# Altium project lsr_pwr.PrjPCB
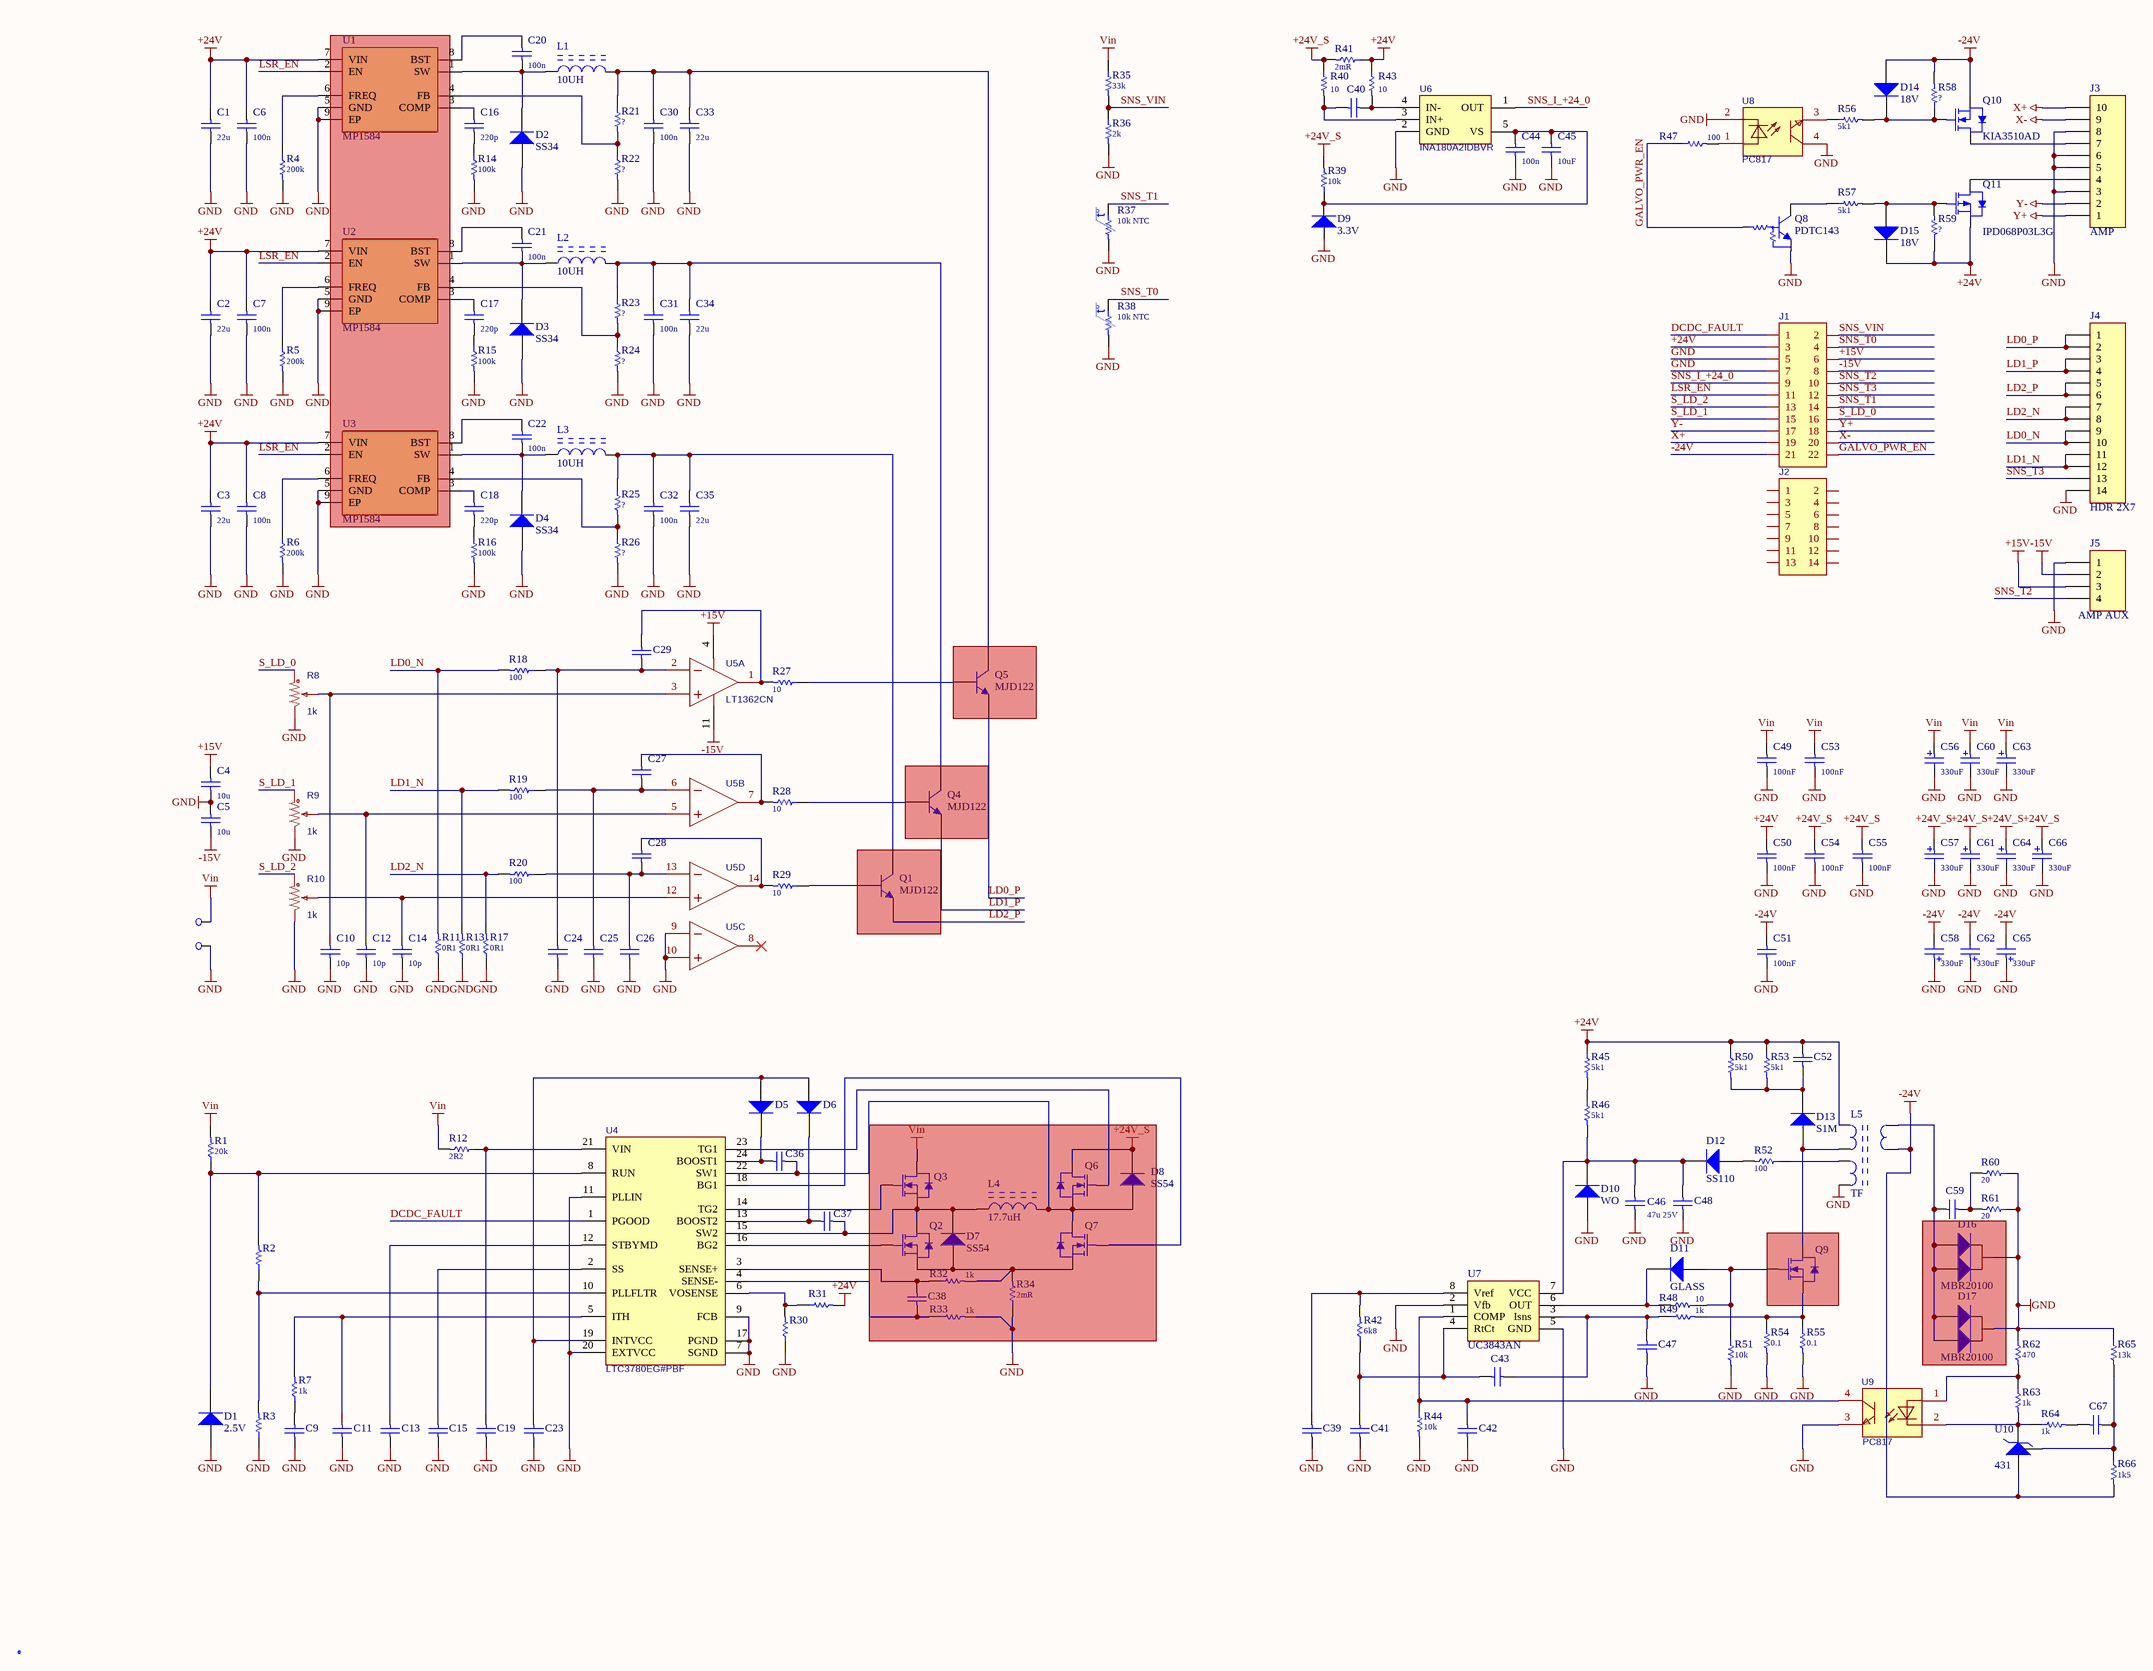
[diagram p0: schematic.SchDoc]
PRJ_ID: LSR Power; PRJ_VER: v1.0.0
1 sheet, 184 parts. Net scope: global (net labels, ports and power ports of the same name join across sheets).
Board file: board.PcbDoc

## Sheet schematic.SchDoc: Display & buttons board
size A2; Revision: 1; SheetNumber: 6; SheetTotal: 29

### Parts
C1  22u  [C1210]
C2  22u  [C1210]
C3  22u  [C1210]
C4  10u  [C1210]
C5  10u  [C1210]
C6  100n  [C0603]
C7  100n  [C0603]
C8  100n  [C0603]
C9  (no value)  [C0805]  (no BOM)
C10  10p  [C0402]
C11  (no value)  [C0805]  (no BOM)
C12  10p  [C0402]
C13  (no value)  [C0805]  (no BOM)
C14  10p  [C0402]
C15  (no value)  [C1206]  (no BOM)
C16  220p  [C0603]
C17  220p  [C0603]
C18  220p  [C0603]
C19  (no value)  [C0805]  (no BOM)
C20  100n  [C0603]
C21  100n  [C0603]
C22  100n  [C0603]
C23  (no value)  [C1206]  (no BOM)
C24  10p  [C0402]  (value not drawn)
C25  10p  [C0402]  (value not drawn)
C26  10p  [C0402]  (value not drawn)
C27  10p  [C0402]  (value not drawn)
C28  10p  [C0402]  (value not drawn)
C29  10p  [C0402]  (value not drawn)
C30  100n  [C0603]
C31  100n  [C0603]
C32  100n  [C0603]
C33  22u  [C1210]
C34  22u  [C1210]
C35  22u  [C1210]
C36  (no value)  [C0805]  (no BOM)
C37  (no value)  [C0805]  (no BOM)
C38  (no value)  [C0805]  (no BOM)
C39  (no value)  [C0805]  (no BOM)
C40  (no value)  [C0805]
C41  (no value)  [C0805]  (no BOM)
C42  (no value)  [C0805]  (no BOM)
C43  (no value)  [C0805]  (no BOM)
C44  100n  [C0603]
C45  10uF  [C0805]
C46  47u 25V  [C7343]  (no BOM)
C47  (no value)  [C0805]  (no BOM)
C48  (no value)  [C0805]  (no BOM)
C49  100nF  [C1210]
C50  100nF  [C1210]
C51  100nF  [C1210]
C52  (no value)  [C1206]  (no BOM)
C53  100nF  [C1210]
C54  100nF  [C1210]
C55  100nF  [C1210]
C56  330uF  [CAP-SMD_BD10.0-L10.3-W10.3-LS11.0-FD]
C57  330uF  [CAP-SMD_BD10.0-L10.3-W10.3-LS11.0-FD]
C58  330uF  [CAP-SMD_BD10.0-L10.3-W10.3-LS11.0-FD]
C59  (no value)  [C1206]  (no BOM)
C60  330uF  [CAP-SMD_BD10.0-L10.3-W10.3-LS11.0-FD]
C61  330uF  [CAP-SMD_BD10.0-L10.3-W10.3-LS11.0-FD]
C62  330uF  [CAP-SMD_BD10.0-L10.3-W10.3-LS11.0-FD]
C63  330uF  [CAP-SMD_BD10.0-L10.3-W10.3-LS11.0-FD]
C64  330uF  [CAP-SMD_BD10.0-L10.3-W10.3-LS11.0-FD]
C65  330uF  [CAP-SMD_BD10.0-L10.3-W10.3-LS11.0-FD]
C66  330uF  [CAP-SMD_BD10.0-L10.3-W10.3-LS11.0-FD]
C67  (no value)  [C0805]  (no BOM)
D1  2.5V  [sod-123]
D2  SS34  [SMA]
D3  SS34  [SMA]
D4  SS34  [SMA]
D5  (no value)  [SOD-323]  (no BOM)
D6  (no value)  [SOD-323]  (no BOM)
D7  SS54  [SMB]  (no BOM)
D8  SS54  [SMB]  (no BOM)
D9  3.3V  [sod-123]
D10  WO  [SMA]  (no BOM)
D11  GLASS  [SMA]  (no BOM)
D12  SS110  [SMA]  (no BOM)
D13  S1M  [SMA]  (no BOM)
D14  18V  [SOD-123]
D15  18V  [SOD-123]
D16  MBR20100  [D2PAK]
D17  MBR20100  [D2PAK]
DN1  (no value)  [PAD_CAST2_0.8MM]  (no BOM)
DN2  (no value)  [PAD_CAST2_0.8MM]  (no BOM)
J1  (no value)  [HDR-2X11-P2.00]
J2  (no value)  [HDR-2X7-P2.00]
J3  AMP  [HDR-1X10_2.54]  (no BOM)
J4  HDR 2X7  [HDR-2X7-P2.00]
J5  AMP AUX  [HDR-2X2-P2.00]  (no BOM)
L1  10UH  [IND-SMD_L7.2-W6.6_GPSR07X0]
L2  10UH  [IND-SMD_L7.2-W6.6_GPSR07X0]
L3  10UH  [IND-SMD_L7.2-W6.6_GPSR07X0]
L4  17.7uH  [IND_PWR_0]  (no BOM)
L5  TF  [TRANS_0]  (no BOM)
LOGO1  LOGO  [LOGO]  (value not drawn)  (no BOM)
Q1  MJD122  [TO-252AA (DPAK)]
Q2  AOD4184  [TO-252AA (DPAK)]  (value not drawn)  (no BOM)
Q3  AOD4184  [TO-252AA (DPAK)]  (value not drawn)  (no BOM)
Q4  MJD122  [TO-252AA (DPAK)]
Q5  MJD122  [TO-252AA (DPAK)]
Q6  AOD4184  [TO-252AA (DPAK)]  (value not drawn)  (no BOM)
Q7  AOD4184  [TO-252AA (DPAK)]  (value not drawn)  (no BOM)
Q8  PDTC143  [SOT-23]
Q9  MDP1991  [D2PAK]  (value not drawn)
Q10  KIA3510AD  [TO-252AA (DPAK)]
Q11  IPD068P03L3G  [TO-252AA (DPAK)]
R1  20k  [R0805]
R2  (no value)  [R0805]  (no BOM)
R3  (no value)  [R0805]  (no BOM)
R4  200k  [R0603]
R5  200k  [R0603]
R6  200k  [R0603]
R7  1k  [R0805]  (no BOM)
R8  1k  [RES-ADJ-TH_3P-L10.0-W10.0-P2.50-L]
R9  1k  [RES-ADJ-TH_3P-L10.0-W10.0-P2.50-L]
R10  1k  [RES-ADJ-TH_3P-L10.0-W10.0-P2.50-L]
R11  0R1  [R1206]
R12  2R2  [R0805]  (no BOM)
R13  0R1  [R1206]
R14  100k  [R0603]
R15  100k  [R0603]
R16  100k  [R0603]
R17  0R1  [R1206]
R18  100  [R0402]
R19  100  [R0402]
R20  100  [R0402]
R21  ?  [R0603]
R22  ?  [R0603]
R23  ?  [R0603]
R24  ?  [R0603]
R25  ?  [R0603]
R26  ?  [R0603]
R27  10  [R0805]
R28  10  [R0805]
R29  10  [R0805]
R30  (no value)  [R0805]  (no BOM)
R31  (no value)  [R0805]  (no BOM)
R32  1k  [R0805]  (no BOM)
R33  1k  [R0805]  (no BOM)
R34  2mR  [R2512-WIDE]  (no BOM)
R35  33k  [R0603]
R36  2k  [R0603]
R37  10k NTC  [R0402]
R38  10k NTC  [R0402]
R39  10k  [R0805]
R40  10  [R0603]
R41  2mR  [R2512-WIDE]
R42  6k8  [R0805]  (no BOM)
R43  10  [R0603]
R44  10k  [R0805]  (no BOM)
R45  5k1  [R1206]  (no BOM)
R46  5k1  [R1206]  (no BOM)
R47  100  [R0603]
R48  10  [R0805]  (no BOM)
R49  1k  [R0805]  (no BOM)
R50  5k1  [R1206]  (no BOM)
R51  10k  [R0805]  (no BOM)
R52  100  [R1206]  (no BOM)
R53  5k1  [R1206]  (no BOM)
R54  0.1  [R1206]  (no BOM)
R55  0.1  [R1206]  (no BOM)
R56  5k1  [R0805]
R57  5k1  [R0805]
R58  ?  [R0805]
R59  ?  [R0805]
R60  20  [R1206]  (no BOM)
R61  20  [R1206]  (no BOM)
R62  470  [R0805]  (no BOM)
R63  1k  [R0805]  (no BOM)
R64  1k  [R0805]  (no BOM)
R65  13k  [R0805]  (no BOM)
R66  1k5  [R0805]  (no BOM)
U1  MP1584  [PowerSOIC-8]
U2  MP1584  [PowerSOIC-8]
U3  MP1584  [PowerSOIC-8]
U4  LTC3780EG#PBF  [SSOP-24]  (no BOM)
U5  LT1362CN  [DIP-14]  (parts A,B,C,D of 4)
U6  INA180A2IDBVR  [SOT-23-5]
U7  UC3843AN  [SO-8]  (no BOM)
U8  PC817  [SMD-4]
U9  PC817  [SMD-4]  (no BOM)
U10  431  [SOT-23]  (no BOM)

### Nets
+15V: C4.2 J1.6 J5.3 U5.4(V+)
+24V: C1.2 C2.2 C3.2 C6.2 C7.2 C8.2 C50.2 C52.1 D15.2(K) J1.3 L5.1 Q11.3(SOURCE) R31.2 R41.1 R43.1 R45.1 R50.1 R53.1 R59.1 U1.7(VIN) U2.7(VIN) U3.7(VIN)
+24V_S: C54.2 C55.2 C57.1 C61.1 C64.1 C66.1 D8.2(K) Q6.2(DRAIN) R39.2 R40.1 R41.2
-15V: C5.1 J1.8 J5.2 U5.11(V-)
-24V: C51.2 C58.2 C62.2 C65.2 D14.1(A) J1.21 L5.5 Q10.3(SOURCE) R58.2 R66.2 U10.3(A)
GND: C1.1 C2.1 C3.1 C4.1 C5.2 C6.1 C7.1 C8.1 C9.2 C10.1 C11.2 C12.1 C13.2 C14.1 C15.2 C19.2 C23.2 C24.1 C25.1 C26.1 C30.1 C31.1 C32.1 C33.1 C34.1 C35.1 C39.2 C41.2 C42.1 C44.1 C45.1 C46.2 C47.2 C48.2 C49.1 C50.1 C51.1 C53.1 C54.1 C55.1 C56.2 C57.2 C58.1 C60.2 C61.2 C62.1 C63.2 C64.2 C65.1 C66.2 D1.1(A) D2.1(A) D3.1(A) D4.1(A) D9.1(A) D10.1(A) D16.2(A) D17.2(A) DN2.1 J1.5 J1.7 J3.3 J3.5 J3.6 J3.8 J4.14 J5.1 L5.3 Q8.2(E) R3.1 R4.2 R5.2 R6.2 R8.3 R9.3 R10.3 R11.1 R13.1 R14.2 R15.2 R16.2 R17.1 R22.2 R24.2 R26.2 R30.1 R33.2 R34.1 R36.2 R37.2 R38.2 R44.2 R51.2 R54.2 R55.2 R60.1 R61.1 R62.1 R65.1 U1.5(GND) U1.9(EP) U2.5(GND) U2.9(EP) U3.5(GND) U3.9(EP) U4.7(SGND) U4.9(FCB) U4.11(PLLIN) U4.17(PGND) U4.20(EXTVCC) U5.9(INC-) U5.10(INC+) U6.2(GND) U7.2(Vfb) U7.5(GND) U8.2 U8.4 U9.3
Vin: C49.2 C53.2 C56.1 C60.1 C63.1 DN1.1 Q3.2(DRAIN) R1.2 R12.2 R35.1
X+: J1.19 J3.10
X-: J1.20 J3.9
Y+: J1.18 J3.1
Y-: J1.17 J3.2
DCDC_FAULT: J1.1 U4.1(PGOOD)
GALVO_PWR_EN: J1.22 Q8.1(B) R47.1
LD0_N: J4.9 J4.10 R11.2 R18.2
LD0_P: J4.1 J4.2 Q5.3(E)
LD1_N: J4.11 J4.12 R13.2 R19.2
LD1_P: J4.3 J4.4 Q4.3(E)
LD2_N: J4.7 J4.8 R17.2 R20.2
LD2_P: J4.5 J4.6 Q1.3(E)
LSR_EN: J1.11 U1.2(EN) U2.2(EN) U3.2(EN)
S_LD_0: J1.16 R8.1
S_LD_1: J1.15 R9.1
S_LD_2: J1.13 R10.1
SNS_I_+24_0: J1.9 U6.1(OUT)
SNS_T0: J1.4 R38.1
SNS_T1: J1.14 R37.1
SNS_T2: J1.10 J5.4
SNS_T3: J1.12 J4.13
SNS_VIN: J1.2 R35.2 R36.1
NetC9_1: C9.1 R7.1
NetC10_2: C10.2 R8.2 U5.3(INA+)
NetC11_1: C11.1 R7.2 U4.5(ITH)
NetC12_2: C12.2 R9.2 U5.5(INB+)
NetC13_1: C13.1 U4.12(STBYMD)
NetC14_2: C14.2 R10.2 U5.12(IND+)
NetC15_1: C15.1 U4.2(SS)
NetC16_1: C16.1 R14.1
NetC16_2: C16.2 U1.3(COMP)
NetC17_1: C17.1 R15.1
NetC17_2: C17.2 U2.3(COMP)
NetC18_1: C18.1 R16.1
NetC18_2: C18.2 U3.3(COMP)
NetC19_1: C19.1 R12.1 U4.21(VIN)
NetC20_1: C20.1 D2.2(K) L1.1 U1.1(SW)
NetC20_2: C20.2 U1.8(BST)
NetC21_1: C21.1 D3.2(K) L2.1 U2.1(SW)
NetC21_2: C21.2 U2.8(BST)
NetC22_1: C22.1 D4.2(K) L3.1 U3.1(SW)
NetC22_2: C22.2 U3.8(BST)
NetC23_1: C23.1 D5.1(A) D6.1(A) U4.19(INTVCC)
NetC24_2: C24.2 C29.2 R18.1 U5.2(INA-)
NetC25_2: C25.2 C27.1 R19.1 U5.6(INB-)
NetC26_2: C26.2 C28.1 R20.1 U5.13(IND-)
NetC27_2: C27.2 R28.2 U5.7(OUTB)
NetC28_2: C28.2 R29.2 U5.14(OUTD)
NetC29_1: C29.1 R27.2 U5.1(OUTA)
NetC30_2: C30.2 C33.2 L1.2 Q5.2(C) R21.1
NetC31_2: C31.2 C34.2 L2.2 Q4.2(C) R23.1
NetC32_2: C32.2 C35.2 L3.2 Q1.2(C) R25.1
NetC36_1: C36.1 D5.2(K) U4.24(BOOST1)
NetC36_2: C36.2 D8.1(A) L4.2 Q6.3(SOURCE) Q7.2(DRAIN) U4.22(SW1)
NetC37_1: C37.1 D6.2(K) U4.13(BOOST2)
NetC37_2: C37.2 D7.2(K) L4.1 Q2.2(DRAIN) Q3.3(SOURCE) U4.15(SW2)
NetC38_1: C38.1 R32.1 U4.3(SENSE+)
NetC38_2: C38.2 R33.1 U4.4(SENSE-)
NetC39_1: C39.1 R42.2 U7.8(Vref)
NetC40_1: C40.1 R40.2 U6.3(IN+)
NetC40_2: C40.2 R43.2 U6.4(IN-)
NetC41_1: C41.1 C43.1 R42.1 U7.4(RtCt)
NetC42_2: C42.2 R44.1 U7.1(COMP) U9.4
NetC43_2: C43.2 C47.1 R49.1 U7.3(Isns)
NetC44_2: C44.2 C45.2 D9.2(K) R39.1 U6.5(VS)
NetC46_1: C46.1 C48.1 D10.2(K) D12.2(K) R46.2 U7.7(VCC)
NetC52_2: C52.2 D13.2(K) R50.2 R53.2
NetC59_1: C59.1 R60.2 R61.2
NetC59_2: C59.2 D16.1(K) D16.3(K) D17.1(K) D17.3(K) L5.6
NetC67_1: C67.1 R65.2 R66.1 U10.1(REF)
NetC67_2: C67.2 R64.2
NetD1_2: D1.2(K) R1.1 R2.2 U4.8(RUN)
NetD7_1: D7.1(A) Q2.3(SOURCE) Q7.3(SOURCE) R32.2 R34.2
NetD11_1: D11.1(A) Q9.1(GATE) R48.1 R51.1
NetD11_2: D11.2(K) R48.2 U7.6(OUT)
NetD12_1: D12.1(A) R52.2
NetD13_1: D13.1(A) L5.2 Q9.2(DRAIN)
NetD14_2: D14.2(K) Q10.1(GATE) R56.2 R58.1
NetD15_1: D15.1(A) Q11.1(GATE) R57.2 R59.2
NetJ3_4: J3.4 Q11.2(DRAIN)
NetJ3_7: J3.7 Q10.2(DRAIN)
NetL5_4: L5.4 R52.1
NetQ1_1: Q1.1(B) R29.1
NetQ2_1: Q2.1(GATE) U4.16(BG2)
NetQ3_1: Q3.1(GATE) U4.14(TG2)
NetQ4_1: Q4.1(B) R28.1
NetQ5_1: Q5.1(B) R27.1
NetQ6_1: Q6.1(GATE) U4.23(TG1)
NetQ7_1: Q7.1(GATE) U4.18(BG1)
NetQ8_3: Q8.3(C) R57.1
NetQ9_3: Q9.3(SOURCE) R49.2 R54.1 R55.1
NetR2_1: R2.1 R3.2 U4.10(PLLFLTR)
NetR4_1: R4.1 U1.6(FREQ)
NetR5_1: R5.1 U2.6(FREQ)
NetR6_1: R6.1 U3.6(FREQ)
NetR21_2: R21.2 R22.1 U1.4(FB)
NetR23_2: R23.2 R24.1 U2.4(FB)
NetR25_2: R25.2 R26.1 U3.4(FB)
NetR30_2: R30.2 R31.1 U4.6(VOSENSE)
NetR45_2: R45.2 R46.1
NetR47_2: R47.2 U8.1
NetR56_1: R56.1 U8.3
NetR62_2: R62.2 R63.1 U9.1
NetR63_2: R63.2 R64.1 U9.2 U10.2(C)

Not connected (* = marked no-connect by the designer): J2 1 2 3 4 5 6 7 8 9 10 11 12 13 14; U5 8(OUTC)*

### Notes on the sheet
- (in symbol RES) t°

### Library data of the parts
C1-C3 C6-C48 C52 C59 C67 = CAP
C4 C5 = CAP: 10u 1210
C49-C51 C53-C55 = CAP: 100nF 1210
C56-C58 C60-C66 = CAP_POL: 330uF 35V; P/N: SVZ1VM471GCRE00RAXXX; LCSC part number: C2939792
D1 = US1M-13-F: P/N: BZT52C2V7; LCSC part number: C406712
D2-D8 D10-D15 = US1M-13-F
D9 = US1M-13-F: P/N: BZT52C3V3; LCSC part number: C173413
DN1 DN2 = dummy net
J1 = HDR 2X11
J2 = HDR 2X7
J3 = Header 3
J5 = Header 2
L1-L3 = SRN3015-100M: CYA0630-10UH
L4 = 7443551331: 17x10x7 RING 14 TURN
L5 = 7443551331
Q1 Q4 Q5 = MMBT2222ALT1G: P/N: MJD122
Q2 Q3 Q6 Q7 Q9 Q11 = 2N7002
Q8 = MMBT2222ALT1G: PDTC143XT,215; LCSC part number: C183011; P/N: PDTC143XT,215
Q10 = 2N7002: AOD4184
R1-R7 R11-R33 R35 R36 R39 R40 R42-R46 R48-R66 = RES
R8-R10 = 10kΩ
R34 R41 = RES: 2mR shunt 2512; P/N: PA2512FKF7T0R002E; LCSC part number: C728320
R37 R38 = RES: 10k NTC 3434 0402; P/N: QN0402X103J3435HA; LCSC part number: C700820
R47 = RES: 100 0603
U5 = LT1362CS#PBF
U8 U9 = PC817C_C3025164
U10 = NCP51460SN33T1G